# Altium project Sayma_AMC.PrjPcb (part 4 of 18)

## Sheet FMC_connector.SchDoc: Sayma AMC
size 420 x 297 mm; $$Internal___BlkDate: 17:09:51_11-23-16; $$Internal_Resolution: 00001mm; $$NotCommonProperty_@NAME: FMC_connector; $$NotCommonProperty_@PRINTORDER: 10; $$NotCommonProperty_@SHEET: 1; $$NotCommonProperty_@SHEETTOTAL: 30; $$NotCommonProperty_FORWARD_PCB: 0; CmpIndex: 290; Drawing Author: G.Kasprowicz; Drawing Number: Sayma AMC; Drawing Project: AMC FMC Carrier Board; Drawing Revision: 2.0; SymIndex: 1557; CheckedBy: P.Kulik,T.Przywozki,W.Ruclo; Author: G.Kasprowicz; CompanyName: WUT ISE; DrawnBy: G.Kasprowicz; Organization: WUT ISE; Address1: PW ISE; Address2: Nowowiejska 15/19 00-665 Warsaw; Address3: gkasprow@gmail.com; DocumentNumber: 4; Revision: 2; SheetNumber: 4; SheetTotal: 32; ModifiedBy: -; CheckedDate: -; Title2: FMC connector; DivGrp: WUT ISE; Designer: G.Kasprowicz; ModifiedDate: -; ProjectName: Sensor Box
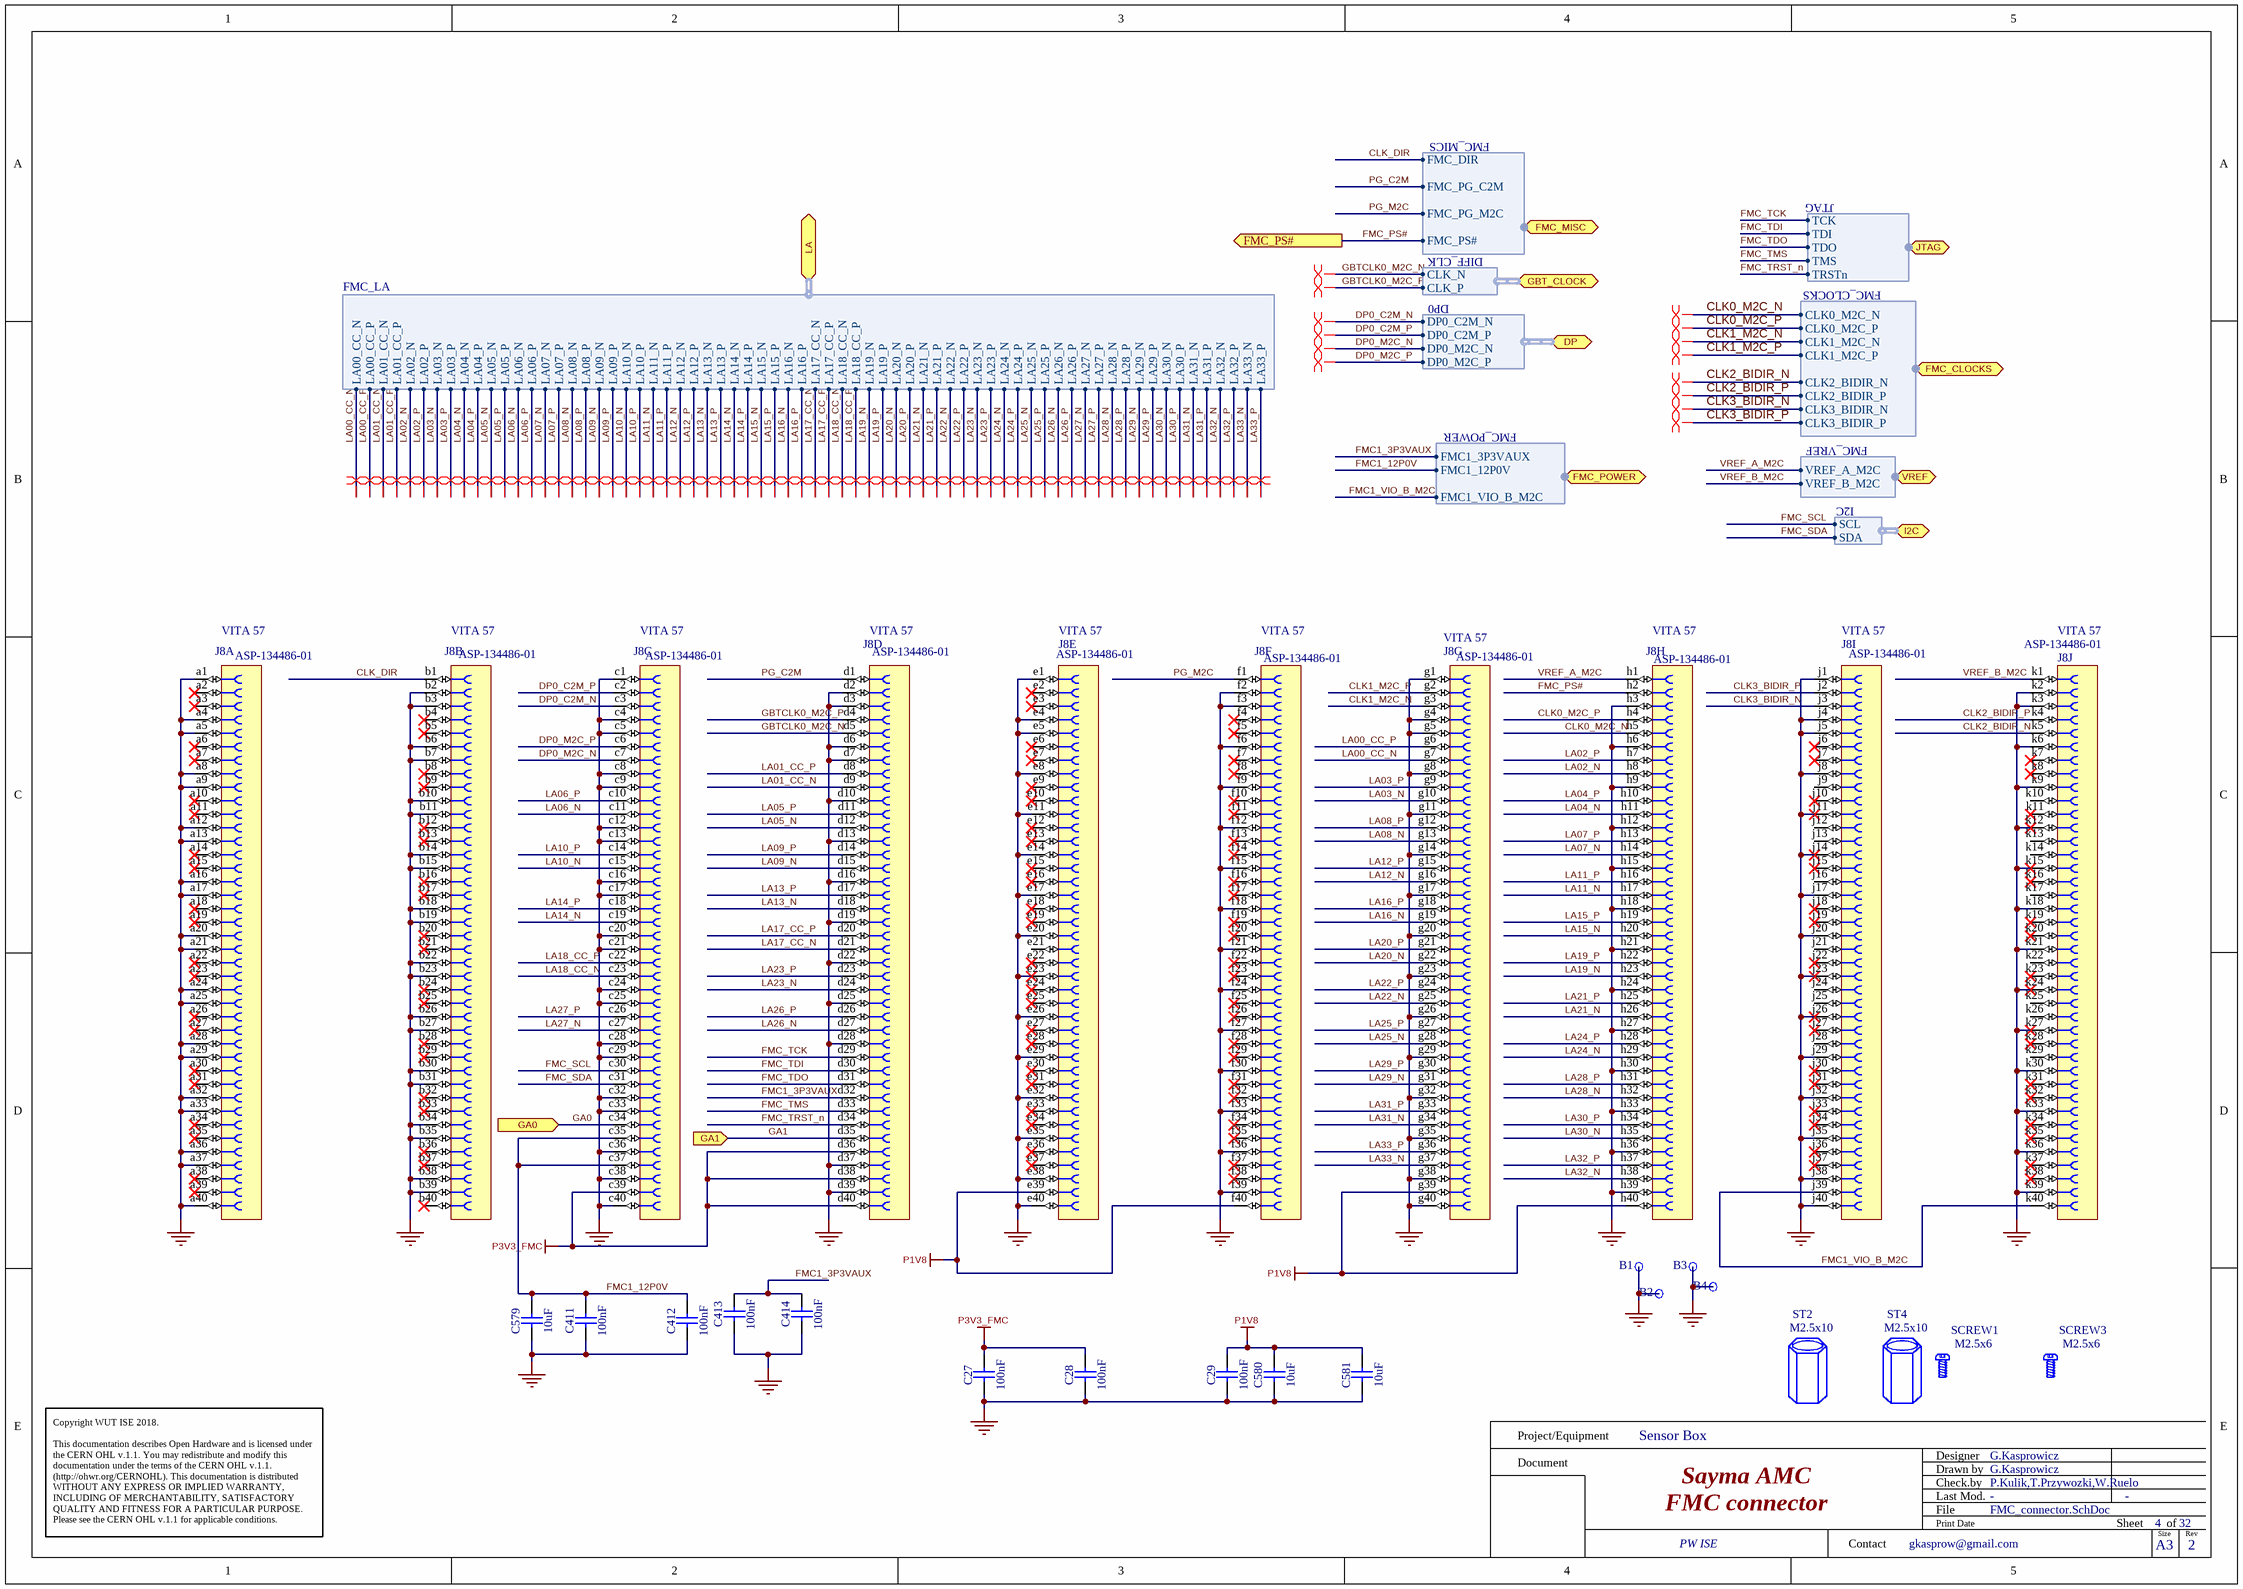
[diagram p5: FMC_connector.SchDoc]

### Parts
B1  PLATED_HOLE2.7_PAD5.0  [MTG270_500]  (value not drawn)
B2  PLATED_HOLE2.7_PAD5.0  [MTG270_500]  (value not drawn)
B3  PLATED_HOLE2.7_PAD5.0  [MTG270_500]  (value not drawn)
B4  PLATED_HOLE2.7_PAD5.0  [MTG270_500]  (value not drawn)
C27  100nF  [CAPC0603X33N]
C28  100nF  [CAPC0603X33N]
C29  100nF  [CAPC0603X33N]
C411  100nF  [CAPC1005X55N]
C412  100nF  [CAPC1005X55N]
C413  100nF  [CAPC1005X55N]
C414  100nF  [CAPC1005X55N]
C579  10uF  [CAPC3216X180N]
C580  10uF  [CAPC3216X180N]
C581  10uF  [CAPC3216X180N]
J8  VITA 57  Manufacturer Part Number: ASP-134486-01  [SAMTEC_ASP-134486-01]  (parts A,B,C,D,E,F,G,H,I,J of 10)
SCREW1  M2.5x6  [BOSSARD_BN5687-3061597_v]
SCREW3  M2.5x6  [BOSSARD_BN5687-3061597_v]
ST2  M2.5x10  [HARWIN_R25-1001002]
ST4  M2.5x10  [HARWIN_R25-1001002]

### Ports
DP (bidir, harness DP0), FMC_CLOCKS (bidir, harness FMC_CLOCKS), FMC_MISC (bidir, harness FMC_MICS), FMC_POWER (bidir, harness FMC_POWER), FMC_PS# (out), GA0 (in), GA1 (in), GBT_CLOCK (bidir, harness DIFF_CLK), I2C (bidir, harness I2C), JTAG (bidir, harness JTAG), LA (bidir, harness FMC_LA), VREF (bidir, harness FMC_VREF)

### Harnesses
FMC_LA: LA00_CC_N, LA00_CC_P, LA01_CC_N, LA01_CC_P, LA02_N, LA02_P, LA03_N, LA03_P, LA04_N, LA04_P, LA05_N, LA05_P, LA06_N, LA06_P, LA07_N, LA07_P, LA08_N, LA08_P, LA09_N, LA09_P, LA10_N, LA10_P, LA11_N, LA11_P, LA12_N, LA12_P, LA13_N, LA13_P, LA14_N, LA14_P, LA15_N, LA15_P, LA16_N, LA16_P, LA17_CC_N, LA17_CC_P, LA18_CC_N, LA18_CC_P, LA19_N, LA19_P, LA20_N, LA20_P, LA21_N, LA21_P, LA22_N, LA22_P, LA23_N, LA23_P, LA24_N, LA25_N, LA25_P, LA24_P, LA26_N, LA26_P, LA27_N, LA27_P, LA28_N, LA28_P, LA29_N, LA29_P, LA30_N, LA30_P, LA31_N, LA31_P, LA32_N, LA32_P, LA33_N, LA33_P
FMC_POWER: FMC1_3P3VAUX, FMC1_12P0V, FMC1_VIO_B_M2C
JTAG: TCK, TDI, TDO, TMS, TRSTn
FMC_MICS: FMC_PS#, FMC_PG_M2C, FMC_PG_C2M, FMC_DIR
DP0: DP0_C2M_N, DP0_C2M_P, DP0_M2C_N, DP0_M2C_P
DIFF_CLK: CLK_P, CLK_N
FMC_CLOCKS: CLK0_M2C_N, CLK0_M2C_P, CLK1_M2C_N, CLK1_M2C_P, CLK2_BIDIR_N, CLK2_BIDIR_P, CLK3_BIDIR_N, CLK3_BIDIR_P
FMC_VREF: VREF_A_M2C, VREF_B_M2C
I2C: SCL, SDA

### Nets
GND: B1.1 B2.1 B3.1 B4.1 C27.2 C28.2 C29.2 C411.1 C412.1 C413.1 C414.1 C579.1 C580.1 C581.1 J8.a1 J8.a4 J8.a5 J8.a8 J8.a9 J8.a12 J8.a13 J8.a16 J8.a17 J8.a20 J8.a21 J8.a24 J8.a25 J8.a28 J8.a29 J8.a32 J8.a33 J8.a36 J8.a37 J8.a40 J8.b2 J8.b3 J8.b6 J8.b7 J8.b10 J8.b11 J8.b14 J8.b15 J8.b18 J8.b19 J8.b22 J8.b23 J8.b26 J8.b27 J8.b30 J8.b31 J8.b34 J8.b35 J8.b38 J8.b39 J8.c1 J8.c4 J8.c5 J8.c8 J8.c9 J8.c12 J8.c13 J8.c16 J8.c17 J8.c20 J8.c21 J8.c24 J8.c25 J8.c28 J8.c29 J8.c32 J8.c33 J8.c34 J8.c36 J8.c38 J8.c40 J8.d2 J8.d3 J8.d6 J8.d7 J8.d10 J8.d13 J8.d16 J8.d19 J8.d22 J8.d25 J8.d28 J8.d35 J8.d37 J8.d39 J8.e1 J8.e4 J8.e5 J8.e8 J8.e11 J8.e14 J8.e17 J8.e20 J8.e23 J8.e26 J8.e29 J8.e32 J8.e35 J8.e38 J8.e40 J8.f2 J8.f3 J8.f6 J8.f9 J8.f12 J8.f15 J8.f18 J8.f21 J8.f24 J8.f27 J8.f30 J8.f33 J8.f36 J8.f39 J8.g1 J8.g4 J8.g5 J8.g8 J8.g11 J8.g14 J8.g17 J8.g20 J8.g23 J8.g26 J8.g29 J8.g32 J8.g35 J8.g38 J8.g40 J8.h3 J8.h6 J8.h9 J8.h12 J8.h15 J8.h18 J8.h21 J8.h24 J8.h27 J8.h30 J8.h33 J8.h36 J8.h39 J8.j1 J8.j4 J8.j5 J8.j8 J8.j11 J8.j14 J8.j17 J8.j20 J8.j23 J8.j26 J8.j29 J8.j32 J8.j35 J8.j38 J8.j40 J8.k2 J8.k3 J8.k6 J8.k9 J8.k12 J8.k15 J8.k18 J8.k21 J8.k24 J8.k27 J8.k30 J8.k33 J8.k36 J8.k39 ; port GA0, port GA1  [also labelled GA0, GA1]
P1V8: C29.1 C580.2 C581.2 J8.e39 J8.f40 J8.g39 J8.h40
P3V3_FMC: C27.1 C28.1 J8.c39 J8.d36 J8.d38 J8.d40
CLK0_M2C_N: J8.h5 ; port FMC_CLOCKS.CLK0_M2C_N
CLK0_M2C_P: J8.h4 ; port FMC_CLOCKS.CLK0_M2C_P
CLK1_M2C_N: J8.g3 ; port FMC_CLOCKS.CLK1_M2C_N
CLK1_M2C_P: J8.g2 ; port FMC_CLOCKS.CLK1_M2C_P
CLK2_BIDIR_N: J8.k5 ; port FMC_CLOCKS.CLK2_BIDIR_N
CLK2_BIDIR_P: J8.k4 ; port FMC_CLOCKS.CLK2_BIDIR_P
CLK3_BIDIR_N: J8.j3 ; port FMC_CLOCKS.CLK3_BIDIR_N
CLK3_BIDIR_P: J8.j2 ; port FMC_CLOCKS.CLK3_BIDIR_P
CLK_DIR: J8.b1 ; port FMC_MISC.FMC_DIR
DP0_C2M_N: J8.c3 ; port DP.DP0_C2M_N
DP0_C2M_P: J8.c2 ; port DP.DP0_C2M_P
DP0_M2C_N: J8.c7 ; port DP.DP0_M2C_N
DP0_M2C_P: J8.c6 ; port DP.DP0_M2C_P
FMC1_3P3VAUX: C413.2 C414.2 J8.d32 ; port FMC_POWER.FMC1_3P3VAUX
FMC1_12P0V: C411.2 C412.2 C579.2 J8.c35 J8.c37 ; port FMC_POWER.FMC1_12P0V
FMC1_VIO_B_M2C: J8.j39 J8.k40 ; port FMC_POWER.FMC1_VIO_B_M2C
FMC_PS#: J8.h2 ; port FMC_PS#, port FMC_MISC.FMC_PS#  [project net FMC1_PS#]
FMC_SCL: J8.c30 ; port I2C.SCL
FMC_SDA: J8.c31 ; port I2C.SDA
FMC_TCK: J8.d29 ; port JTAG.TCK  [project net FMC1_TCK]
FMC_TDI: J8.d30 ; port JTAG.TDI  [project net FMC1_TDI]
FMC_TDO: J8.d31 ; port JTAG.TDO  [project net FMC1_TDO]
FMC_TMS: J8.d33 ; port JTAG.TMS  [project net FMC1_TMS]
FMC_TRST_n: J8.d34 ; port JTAG.TRSTn  [project net FMC1_TRST_n]
GBTCLK0_M2C_N: J8.d5 ; port GBT_CLOCK.CLK_N  [project net FMC1_GBTCLK0_M2C_N]
GBTCLK0_M2C_P: J8.d4 ; port GBT_CLOCK.CLK_P  [project net FMC1_GBTCLK0_M2C_P]
LA00_CC_N: J8.g7 ; port LA.LA00_CC_N  [project net FMC1_LA00_CC_N]
LA00_CC_P: J8.g6 ; port LA.LA00_CC_P  [project net FMC1_LA00_CC_P]
LA01_CC_N: J8.d9 ; port LA.LA01_CC_N  [project net FMC1_LA01_CC_N]
LA01_CC_P: J8.d8 ; port LA.LA01_CC_P  [project net FMC1_LA01_CC_P]
LA02_N: J8.h8 ; port LA.LA02_N  [project net FMC1_LA02_N]
LA02_P: J8.h7 ; port LA.LA02_P  [project net FMC1_LA02_P]
LA03_N: J8.g10 ; port LA.LA03_N  [project net FMC1_LA03_N]
LA03_P: J8.g9 ; port LA.LA03_P  [project net FMC1_LA03_P]
LA04_N: J8.h11 ; port LA.LA04_N  [project net FMC1_LA04_N]
LA04_P: J8.h10 ; port LA.LA04_P  [project net FMC1_LA04_P]
LA05_N: J8.d12 ; port LA.LA05_N  [project net FMC1_LA05_N]
LA05_P: J8.d11 ; port LA.LA05_P  [project net FMC1_LA05_P]
LA06_N: J8.c11 ; port LA.LA06_N  [project net FMC1_LA06_N]
LA06_P: J8.c10 ; port LA.LA06_P  [project net FMC1_LA06_P]
LA07_N: J8.h14 ; port LA.LA07_N  [project net FMC1_LA07_N]
LA07_P: J8.h13 ; port LA.LA07_P  [project net FMC1_LA07_P]
LA08_N: J8.g13 ; port LA.LA08_N  [project net FMC1_LA08_N]
LA08_P: J8.g12 ; port LA.LA08_P  [project net FMC1_LA08_P]
LA09_N: J8.d15 ; port LA.LA09_N  [project net FMC1_LA09_N]
LA09_P: J8.d14 ; port LA.LA09_P  [project net FMC1_LA09_P]
LA10_N: J8.c15 ; port LA.LA10_N  [project net FMC1_LA10_N]
LA10_P: J8.c14 ; port LA.LA10_P  [project net FMC1_LA10_P]
LA11_N: J8.h17 ; port LA.LA11_N  [project net FMC1_LA11_N]
LA11_P: J8.h16 ; port LA.LA11_P  [project net FMC1_LA11_P]
LA12_N: J8.g16 ; port LA.LA12_N  [project net FMC1_LA12_N]
LA12_P: J8.g15 ; port LA.LA12_P  [project net FMC1_LA12_P]
LA13_N: J8.d18 ; port LA.LA13_N  [project net FMC1_LA13_N]
LA13_P: J8.d17 ; port LA.LA13_P  [project net FMC1_LA13_P]
LA14_N: J8.c19 ; port LA.LA14_N  [project net FMC1_LA14_N]
LA14_P: J8.c18 ; port LA.LA14_P  [project net FMC1_LA14_P]
LA15_N: J8.h20 ; port LA.LA15_N  [project net FMC1_LA15_N]
LA15_P: J8.h19 ; port LA.LA15_P  [project net FMC1_LA15_P]
LA16_N: J8.g19 ; port LA.LA16_N  [project net FMC1_LA16_N]
LA16_P: J8.g18 ; port LA.LA16_P  [project net FMC1_LA16_P]
LA17_CC_N: J8.d21 ; port LA.LA17_CC_N  [project net FMC1_LA17_CC_N]
LA17_CC_P: J8.d20 ; port LA.LA17_CC_P  [project net FMC1_LA17_CC_P]
LA18_CC_N: J8.c23 ; port LA.LA18_CC_N  [project net FMC1_LA18_CC_N]
LA18_CC_P: J8.c22 ; port LA.LA18_CC_P  [project net FMC1_LA18_CC_P]
LA19_N: J8.h23 ; port LA.LA19_N  [project net FMC1_LA19_N]
LA19_P: J8.h22 ; port LA.LA19_P  [project net FMC1_LA19_P]
LA20_N: J8.g22 ; port LA.LA20_N  [project net FMC1_LA20_N]
LA20_P: J8.g21 ; port LA.LA20_P  [project net FMC1_LA20_P]
LA21_N: J8.h26 ; port LA.LA21_N  [project net FMC1_LA21_N]
LA21_P: J8.h25 ; port LA.LA21_P  [project net FMC1_LA21_P]
LA22_N: J8.g25 ; port LA.LA22_N  [project net FMC1_LA22_N]
LA22_P: J8.g24 ; port LA.LA22_P  [project net FMC1_LA22_P]
LA23_N: J8.d24 ; port LA.LA23_N  [project net FMC1_LA23_N]
LA23_P: J8.d23 ; port LA.LA23_P  [project net FMC1_LA23_P]
LA24_N: J8.h29 ; port LA.LA24_N  [project net FMC1_LA24_N]
LA24_P: J8.h28 ; port LA.LA24_P  [project net FMC1_LA24_P]
LA25_N: J8.g28 ; port LA.LA25_N  [project net FMC1_LA25_N]
LA25_P: J8.g27 ; port LA.LA25_P  [project net FMC1_LA25_P]
LA26_N: J8.d27 ; port LA.LA26_N  [project net FMC1_LA26_N]
LA26_P: J8.d26 ; port LA.LA26_P  [project net FMC1_LA26_P]
LA27_N: J8.c27 ; port LA.LA27_N  [project net FMC1_LA27_N]
LA27_P: J8.c26 ; port LA.LA27_P  [project net FMC1_LA27_P]
LA28_N: J8.h32 ; port LA.LA28_N  [project net FMC1_LA28_N]
LA28_P: J8.h31 ; port LA.LA28_P  [project net FMC1_LA28_P]
LA29_N: J8.g31 ; port LA.LA29_N  [project net FMC1_LA29_N]
LA29_P: J8.g30 ; port LA.LA29_P  [project net FMC1_LA29_P]
LA30_N: J8.h35 ; port LA.LA30_N  [project net FMC1_LA30_N]
LA30_P: J8.h34 ; port LA.LA30_P  [project net FMC1_LA30_P]
LA31_N: J8.g34 ; port LA.LA31_N  [project net FMC1_LA31_N]
LA31_P: J8.g33 ; port LA.LA31_P  [project net FMC1_LA31_P]
LA32_N: J8.h38 ; port LA.LA32_N  [project net FMC1_LA32_N]
LA32_P: J8.h37 ; port LA.LA32_P  [project net FMC1_LA32_P]
LA33_N: J8.g37 ; port LA.LA33_N  [project net FMC1_LA33_N]
LA33_P: J8.g36 ; port LA.LA33_P  [project net FMC1_LA33_P]
PG_C2M: J8.d1 ; port FMC_MISC.FMC_PG_C2M  [project net FMC1_PG_C2M]
PG_M2C: J8.f1 ; port FMC_MISC.FMC_PG_M2C  [project net FMC1_PG_M2C]
VREF_A_M2C: J8.h1 ; port VREF.VREF_A_M2C  [project net FMC1_VREF_A_M2C]
VREF_B_M2C: J8.k1 ; port VREF.VREF_B_M2C

Not connected (* = marked no-connect by the designer): J8 a2* a3* a6* a7* a10* a11* a14* a15* a18* a19* a22* a23* a26* a27* a30* a31* a34* a35* a38* a39* b4* b5* b8* b9* b12* b13* b16* b17* b20* b21* b24* b25* b28* b29* b32* b33* b36* b37* b40* e2* e3* e6* e7* e9* e10* e12* e13* e15* e16* e18* e19* e21 e22* e24* e25* e27* e28* e30* e31* e33* e34* e36* e37* f4* f5* f7* f8* f10* f11* f13* f14* f16* f17* f19* f20* f22* f23* f25* f26* f28* f29* f31* f32* f34* f35* f37* f38* j6* j7* j9 j10* j12 j13 j15* j16 j18* j19* j21 j22* j24 j25 j27* j28 j30* j31* j33* j34* j36* j37* k7* k8* k10 k11* k13 k14 k16* k17 k19* k20* k22 k23* k25 k26 k28* k29 k31* k32* k34* k35* k37* k38*

### Layout directives
differential pair: CLK0_M2C_N, CLK0_M2C_P, CLK1_M2C_N, CLK1_M2C_P, CLK2_BIDIR_N, CLK2_BIDIR_P, CLK3_BIDIR_N, CLK3_BIDIR_P, DP0_C2M_N, DP0_C2M_P, DP0_M2C_N, DP0_M2C_P, FMC1_GBTCLK0_M2C_N, FMC1_GBTCLK0_M2C_P, FMC1_LA00_CC_N, FMC1_LA00_CC_P, FMC1_LA01_CC_N, FMC1_LA01_CC_P, FMC1_LA02_N, FMC1_LA02_P, FMC1_LA03_N, FMC1_LA03_P, FMC1_LA04_N, FMC1_LA04_P, FMC1_LA05_N, FMC1_LA05_P, FMC1_LA06_N, FMC1_LA06_P, FMC1_LA07_N, FMC1_LA07_P, FMC1_LA08_N, FMC1_LA08_P, FMC1_LA09_N, FMC1_LA09_P, FMC1_LA10_N, FMC1_LA10_P, FMC1_LA11_N, FMC1_LA11_P, FMC1_LA12_N, FMC1_LA12_P, FMC1_LA13_N, FMC1_LA13_P, FMC1_LA14_N, FMC1_LA14_P, FMC1_LA15_N, FMC1_LA15_P, FMC1_LA16_N, FMC1_LA16_P, FMC1_LA17_CC_N, FMC1_LA17_CC_P, FMC1_LA18_CC_N, FMC1_LA18_CC_P, FMC1_LA19_N, FMC1_LA19_P, FMC1_LA20_N, FMC1_LA20_P, FMC1_LA21_N, FMC1_LA21_P, FMC1_LA22_N, FMC1_LA22_P, FMC1_LA23_N, FMC1_LA23_P, FMC1_LA24_N, FMC1_LA24_P, FMC1_LA25_N, FMC1_LA25_P, FMC1_LA26_N, FMC1_LA26_P, FMC1_LA27_N, FMC1_LA27_P, FMC1_LA28_N, FMC1_LA28_P, FMC1_LA29_N, FMC1_LA29_P, FMC1_LA30_N, FMC1_LA30_P, FMC1_LA31_N, FMC1_LA31_P, FMC1_LA32_N, FMC1_LA32_P, FMC1_LA33_N, FMC1_LA33_P

### Notes on the sheet
- Project/Equipment
- Document
- Designer
- Drawn by
- Check.by
- Copyright WUT ISE 2018.
  This documentation describes Open Hardware and is licensed under the CERN OHL v.1.1. You may redistribute and modify this documentation under the terms of the CERN OHL v.1.1. (http://ohwr.org/CERNOHL). This documentation is distributed WITHOUT ANY EXPRESS OR IMPLIED WARRANTY, INCLUDING OF MERCHANTABILITY, SATISFACTORY QUALITY AND FITNESS FOR A PARTICULAR PURPOSE. Please see the CERN OHL v.1.1 for applicable conditions.
- Contact
- File
- Last Mod.
- Print Date
- Sheet
- Size
- A3
- of
- Rev

### Library data of the parts
B1 = MTG270_500: Part Description: Plated Through Hole: Hole Dia.=2.7mm Pad Dia.=5.0mm; $$Internal_Resolution: 00001mm; $$NotCommonProperty_Family: Plated Hole; $$NotCommonProperty_Mounted: No; $$NotCommonProperty_Pin Count: 1; $$NotCommonProperty_Sense: No; $$NotCommonProperty_Status: None; CmpIndex: 27; DXDB_LIBNAME: Pads; Ref Designator: B1; SymIndex: 1608; $$NotCommonProperty_ComponentHeight: 0mm; $$NotCommonProperty_Footprint Ref: MTG270_500; $$NotCommonProperty_SMD: No; $$NotCommonProperty_Socket: No; Cell Name: MTG270_500; Part Name: PLATED_HOLE2.7_PAD5.0; Part Number: PLATED_HOLE2.7_PAD5.0; Orientation: 0 = 0
B2 = MTG270_500: Part Description: Plated Through Hole: Hole Dia.=2.7mm Pad Dia.=5.0mm; $$Internal_Resolution: 00001mm; $$NotCommonProperty_Family: Plated Hole; $$NotCommonProperty_Mounted: No; $$NotCommonProperty_Pin Count: 1; $$NotCommonProperty_Sense: No; $$NotCommonProperty_Status: None; CmpIndex: 10; DXDB_LIBNAME: Pads; Ref Designator: B2; SymIndex: 1608; $$NotCommonProperty_ComponentHeight: 0mm; $$NotCommonProperty_Footprint Ref: MTG270_500; $$NotCommonProperty_SMD: No; $$NotCommonProperty_Socket: No; Cell Name: MTG270_500; Part Name: PLATED_HOLE2.7_PAD5.0; Part Number: PLATED_HOLE2.7_PAD5.0; Orientation: 0 = 0
B3 = MTG270_500: Part Description: Plated Through Hole: Hole Dia.=2.7mm Pad Dia.=5.0mm; $$Internal_Resolution: 00001mm; $$NotCommonProperty_Family: Plated Hole; $$NotCommonProperty_Mounted: No; $$NotCommonProperty_Pin Count: 1; $$NotCommonProperty_Sense: No; $$NotCommonProperty_Status: None; CmpIndex: 11; DXDB_LIBNAME: Pads; Ref Designator: B3; SymIndex: 1608; $$NotCommonProperty_ComponentHeight: 0mm; $$NotCommonProperty_Footprint Ref: MTG270_500; $$NotCommonProperty_SMD: No; $$NotCommonProperty_Socket: No; Cell Name: MTG270_500; Part Name: PLATED_HOLE2.7_PAD5.0; Part Number: PLATED_HOLE2.7_PAD5.0; Orientation: 0 = 0
B4 = MTG270_500: Part Description: Plated Through Hole: Hole Dia.=2.7mm Pad Dia.=5.0mm; $$Internal_Resolution: 00001mm; $$NotCommonProperty_Family: Plated Hole; $$NotCommonProperty_Mounted: No; $$NotCommonProperty_Pin Count: 1; $$NotCommonProperty_Sense: No; $$NotCommonProperty_Status: None; CmpIndex: 12; DXDB_LIBNAME: Pads; Ref Designator: B4; SymIndex: 1608; $$NotCommonProperty_ComponentHeight: 0mm; $$NotCommonProperty_Footprint Ref: MTG270_500; $$NotCommonProperty_SMD: No; $$NotCommonProperty_Socket: No; Cell Name: MTG270_500; Part Name: PLATED_HOLE2.7_PAD5.0; Part Number: PLATED_HOLE2.7_PAD5.0; Orientation: 0 = 0
C27-C29 = CC0201_100NF_6.3V_10%_X5R: as C44-C90 on sheet SDRAM_DDR3_4x16; Manufacturer Part Number: CC0201_100NF_6.3V_10%_X5R; Part Number: CC0201_100NF_6.3V_10%_X5R; Value: 100nF; Component Kind: Standard; Component Type: Standard; Pin Count: 2; Status: Not Recommended; Case: 0201; Mounted: Yes; Socket: No; SMD: Yes; Sense: No; Manufacturer1 Example: AVX; Manufacturer1 ComponentHeight: 0.33mm; HelpURL: \\cern.ch\dfs\Applications\Altium\Datasheets\CC0201_X5R_AVX.pdf; Author: CERN DEM JLC; CreateDate: 03.12.2007; LatestRevisionDate: 03.12.2007
C411-C414 = CC0402_100NF_16V_10%_X5R: Non-polarised capacitor; Manufacturer: GENERIC; Part Description: SMD Multilayer Chip Ceramic Capacitor; Manufacturer1 Part Number: GRM155R61C104KA88D; Tolerance: ±10%; Voltage: 16V; TC: X5R; Manufacturer Part Number: CC0402_100NF_16V_10%_X5R; Part Number: CC0402_100NF_16V_10%_X5R; Value: 100nF; Component Kind: Standard; Component Type: Standard; Pin Count: 2; Status: None; Case: 0402; Mounted: Yes; Socket: No; SMD: Yes; Sense: No; Manufacturer1 Example: MURATA; Manufacturer1 ComponentHeight: 0.55mm; HelpURL: \\cern.ch\dfs\Applications\Altium\Datasheets\CC0402_X5R_MURATA_GRM.pdf; Author: CERN DEM JLC; CreateDate: 10.12.2013; LatestRevisionDate: 10.12.2013
C579-C581 = CC1206_10uF_25V_10%_X7R: Non-polarised capacitor; Manufacturer: GENERIC; Part Description: SMD Multilayer Chip Ceramic Capacitor; Manufacturer1 Part Number: C1206C106K4RACTU; Tolerance: ±10%; Voltage: 25V; TC: X7R; Manufacturer Part Number: CC1206_10uF_25V_10%_X7R; Part Number: CC1206_10UF_25V_10%_X7R; Value: 10uF; Component Kind: Standard; Component Type: Standard; Pin Count: 2; Status: Preferred; Case: 1206; Mounted: Yes; Socket: No; SMD: Yes; Sense: No; Manufacturer1 Example: KEMET; Manufacturer1 ComponentHeight: 1.8mm; HelpURL: \\cern.ch\dfs\Applications\Altium\Datasheets\CC1206_X7R_KEMET.pdf; Author: CERN DEM JLC; CreateDate: 12.09.2012; LatestRevisionDate: 12.09.2012
J8 = SAMTEC_ASP-134486-01: Connector VITA 57, 400 Female contacts in 10 row abcdefghj; Manufacturer: SAMTEC; Part Description: 400 contacts (10 rows abcdefghj) Surface Mount Female Connector, VITA 57 (CC-HPC-10); PressFit: No; Part Number: SAMTEC_ASP-134486-01; Component Kind: Standard; Component Type: Standard; Pin Count: 400; Family: VITA 57; Mounted: Yes; Socket: No; Sense: No; SMD: Yes; Status: None; ComponentHeight: 6.55mm; HelpURL: \\cern.ch\dfs\Applications\Altium\Datasheets\SAMTEC_ASP-134486-01.pdf; Author: CERN DEM JLC; CreateDate: 30.04.2009; LatestRevisionDate: 17.08.2009
SCREW1 SCREW3 = BOSSARD_BN5687-3061597_v: Screw; Part Description: M2.5 L=6mm Hexalobular Socket Pan Head Screw, Fully Threaded, Stainless Steel A2; Manufacturer Part Number: BN5687 Art.3061597; PressFit: No; Part Number: BOSSARD_BN5687-3061597_v; Component Kind: Standard; Component Type: Mechanical; Pin Count: 0; PackageDescription: M2.5 L=6mm Hexalobular Socket Pan Head Screw, Fully Threaded - Stainless Steel A2; Mounted: Yes; Socket: No; SMD: No; Sense: No; Status: None; Value: M2.5x6; Manufacturer: BOSSARD; ComponentHeight: 2.1mm; HelpURL: \\cern.ch\dfs\Applications\Altium\Datasheets\BOSSARD_BN5687-3061597.pdf; Author: CERN DEM JLC; CreateDate: 30.05.2013; LatestRevisionDate: 30.05.2013
ST2 ST4 = MECH_Standoff_M2.5x10: M2.5x10 standoff; Part Description: M2.5x10 female Hex Spacer made of free-machining brass with nickel plated finish; Manufacturer: HARWIN; Manufacturer Part Number: R25-1001002; PressFit: No; Part Number: HARWIN_R25-1001002; Component Kind: Standard; Component Type: Mechanical; Pin Count: 0; PackageDescription: M2.5 L=6mm Hexalobular Socket Pan Head Screw, Fully Threaded - Stainless Steel A2; Mounted: Yes; Socket: No; SMD: No; Sense: No; Status: None; Value: M2.5x10; ComponentHeight: 10mm; HelpURL: \\cern.ch\dfs\Applications\Altium\Datasheets\BOSSARD_BN5687-3061597.pdf; Author: GK; CreateDate: 25.02.2019; LatestRevisionDate: 25.02.2019